# EAGLE design Protect (EAGLE 8.3.0)
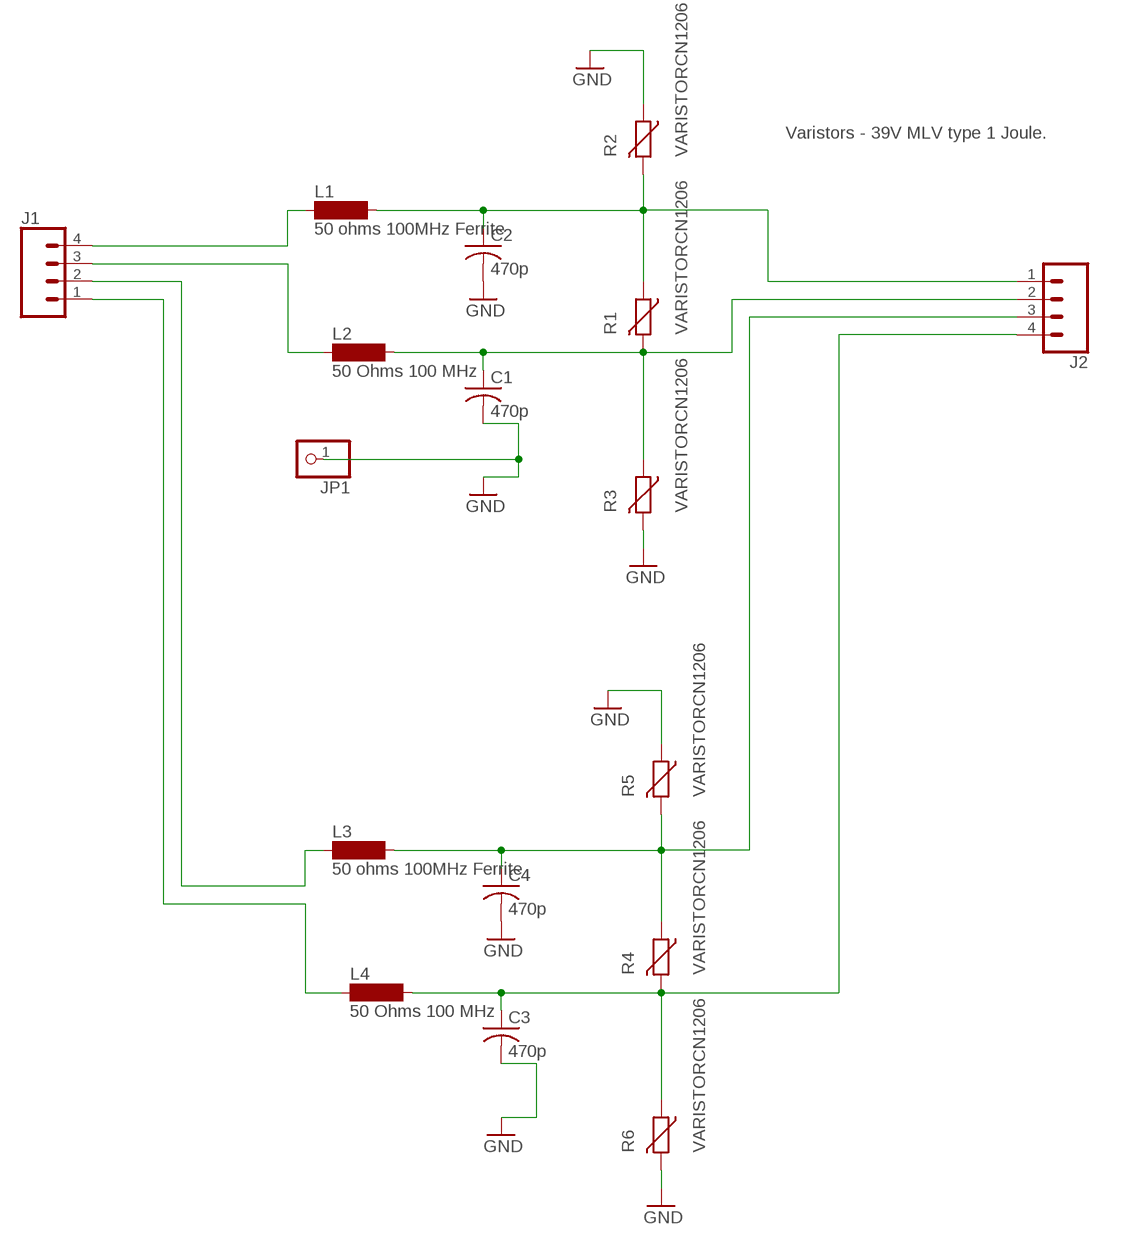
[diagram p0: schematic, sheet 1]

## Parts
C1  470p  C-USC0603K  [C0603K]
C2  470p  C-USC0603K  [C0603K]
C3  470p  C-USC0603K  [C0603K]
C4  470p  C-USC0603K  [C0603K]
J1  CONN_04  [1X04]
J2  CONN_04  [1X04]
JP1  PINHD-1X1  [1X01]
L1  50 ohms 100MHz Ferrite  SM-1206  [SM-1206]
L2  50 Ohms 100 MHz  SM-1206  [SM-1206]
L3  50 ohms 100MHz Ferrite  SM-1206  [SM-1206]
L4  50 Ohms 100 MHz  SM-1206  [SM-1206]
R1  VARISTORCN1206  [CT/CN1206]
R2  VARISTORCN1206  [CT/CN1206]
R3  VARISTORCN1206  [CT/CN1206]
R4  VARISTORCN1206  [CT/CN1206]
R5  VARISTORCN1206  [CT/CN1206]
R6  VARISTORCN1206  [CT/CN1206]

## Nets
GND: C1.2 C2.2 C3.2 C4.2 JP1.1 R2.1 R3.2 R5.1 R6.2
N$1: C2.1 J2.1 L1.2 R1.1 R2.2
N$2: J1.4 L1.1
N$3: C1.1 J2.2 L2.2 R1.2 R3.1
N$4: J1.3 L2.1
N$5: C4.1 J2.3 L3.2 R4.1 R5.2
N$6: C3.1 J2.4 L4.2 R4.2 R6.1
N$7: J1.2 L3.1
N$8: J1.1 L4.1

## Notes on the sheet
- Varistors - 39V MLV type 1 Joule.

## Library data of the parts
C1-C4 = rcl:C-US: CAPACITOR, American symbol
J1 J2 = SparkFun-Connectors:CONN_04: Multi connection point. Often used as Generic Header-pin footprint for 0.1 inch spaced/style header connections On any of the 0.1 inch spaced packages, you can populate with these: Break Away Headers - Straight <https://www.sparkfun.com/products/116> (PRT-00116) Break Away Male Headers - Right Angle <https://www.sparkfun.com/products/553> (PRT-00553) Female Headers <https://www.sparkfun.com/products/115> (PRT-00115) Break Away Headers - Machine Pin <https://www.sparkfun.com/products/117> (PRT-00117) Break Away Female Headers - Swiss Machine Pin <https://www.sparkfun.com/products/743> (PRT-00743) For SCREWTERMINALS and SPRING TERMINALS visit here: Screw Terimnals on SparkFun.com <https://www.sparkfun.com/search/results?term=Screw+Terminals> (5mm/3.5mm/2.54mm spacing) This device is also useful as a general connection point to wire up your design to another part of your project. Our various solder wires solder well into these plated through hole pads. Hook-Up Wire - Assortment (Stranded, 22 AWG) <https://www.sparkfun.com/products/11375> (PRT-11375) Hook-Up Wire - Assortment (Solid Core, 22 AWG) <https://www.sparkfun.com/products/11367> (PRT-11367) View the entire wire category on our website here <https://www.sparkfun.com/categories/141> Special notes: Molex polarized connector foot print use with SKU : PRT-08231 with associated crimp pins and housings. 1MM SMD Version SKU: PRT-10208; PROD_ID: CONN-09696
JP1 = adafruit:PINHD-1X1: Pin header 1x1 for 0.1" spacing With round pins
L1-L4 = inductor-neosid:SM-1206: INDUCTOR SMD chip inductor; OC_FARNELL: unknown; OC_NEWARK: unknown
R1-R6 = varistor:VARISTOR: VARISTOR

## Board
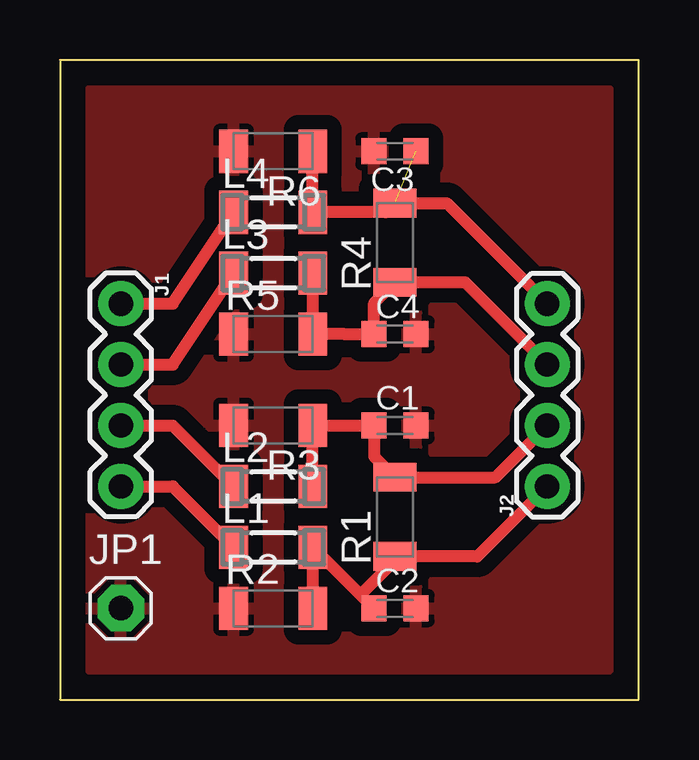
[diagram p1: board, top side]

Size 24.13 x 26.67 mm. Coordinates in mm from the lower left corner, seen from the top.
Outline: 0,0 24.13,0 24.13,26.67 0,26.67 0,0
Copper layers (1*16): Top 0.035mm / dielectric 1.5mm / Bottom 0.035mm
Design rules "default": minimum track width 6mil, minimum drill 0.35mm, track to track 6mil, track to pad 6mil, pad to pad 6mil, via to via 6mil, smd to smd 6mil, copper to edge 40mil, drill to drill 6mil, minimum pad ring 10mil, minimum via ring 8mil, stop-mask expansion 4mil, vias tented up to drill 0mil, thermal gap 10mil

### Footprints (pad centres in the part's own frame; a part is rotated, then mirrored left to right if it is on the bottom)
C0603K = smd 1.05 x 1.08: 1 -0.875,0; 2 0.875,0
1X04 = drill 1.016 pad 1.88: 1 0,0; 2 2.54,0; 3 5.08,0; 4 7.62,0
1X01 = drill 1.016 pad 1.93 octagon: 1 0,0
SM-1206 = smd 1.2 x 1.8: 1 -1.65,0; 2 1.65,0
CT/CN1206 = smd 1.2 x 1.8: 1 -1.65,0; 2 1.65,0

### Placement (x,y rotation side)
C1  13.97,11.43 0 top
C2  13.97,3.81 0 top
C3  13.97,22.86 180 top
C4  13.97,15.24 0 top
J1  2.54,16.51 270 top
J2  20.32,8.89 90 top
JP1  2.54,3.81 0 top
L1  8.89,6.35 0 top
L2  8.89,8.89 0 top
L3  8.89,17.78 0 top
L4  8.89,20.32 0 top
R1  13.97,7.62 90 top
R2  8.89,3.81 0 top
R3  8.89,11.43 180 top
R4  13.97,19.05 90 top
R5  8.89,15.24 0 top
R6  8.89,22.86 180 top

### Tracks (layer width: path | path; a pad name or v marks a point on that pad's centre or on a via)
GND
  pour Top (isolate 0.61): 1.27,25.4 1.27,1.27 22.86,1.27 22.86,25.4
N$1
  Top 0.508: R2.2 L1.2 10.55,6.35 12.54,4.37 | 12.54,4.37 C2.1 | J2.1 17.4,5.97 R1.1 13.97,5.8 12.54,4.37
N$2
  Top 0.508: J1.4 4.7,8.89 L1.1
N$3
  Top 0.508: L2.2 R3.1 C1.1 13.1,10.14 R1.2 18.16,9.27 J2.2
N$4
  Top 0.508: J1.3 4.7,11.43 L2.1
N$5
  Top 0.508: 11.87,15.24 C4.1 13.1,16.53 R4.1 16.89,17.4 J2.3 | 11.87,15.24 R5.2 | L3.2 10.54,15.29 11.87,15.24
N$6  (1 unrouted)
  Top 0.508: R6.1 L4.2 13.59,20.32 R4.2 16.13,20.7 J2.4
N$7
  Top 0.508: J1.2 4.7,13.97 L3.1
N$8
  Top 0.508: J1.1 4.7,16.51 L4.1